# EAGLE schematic md_ver10.1 (EAGLE 6.2)
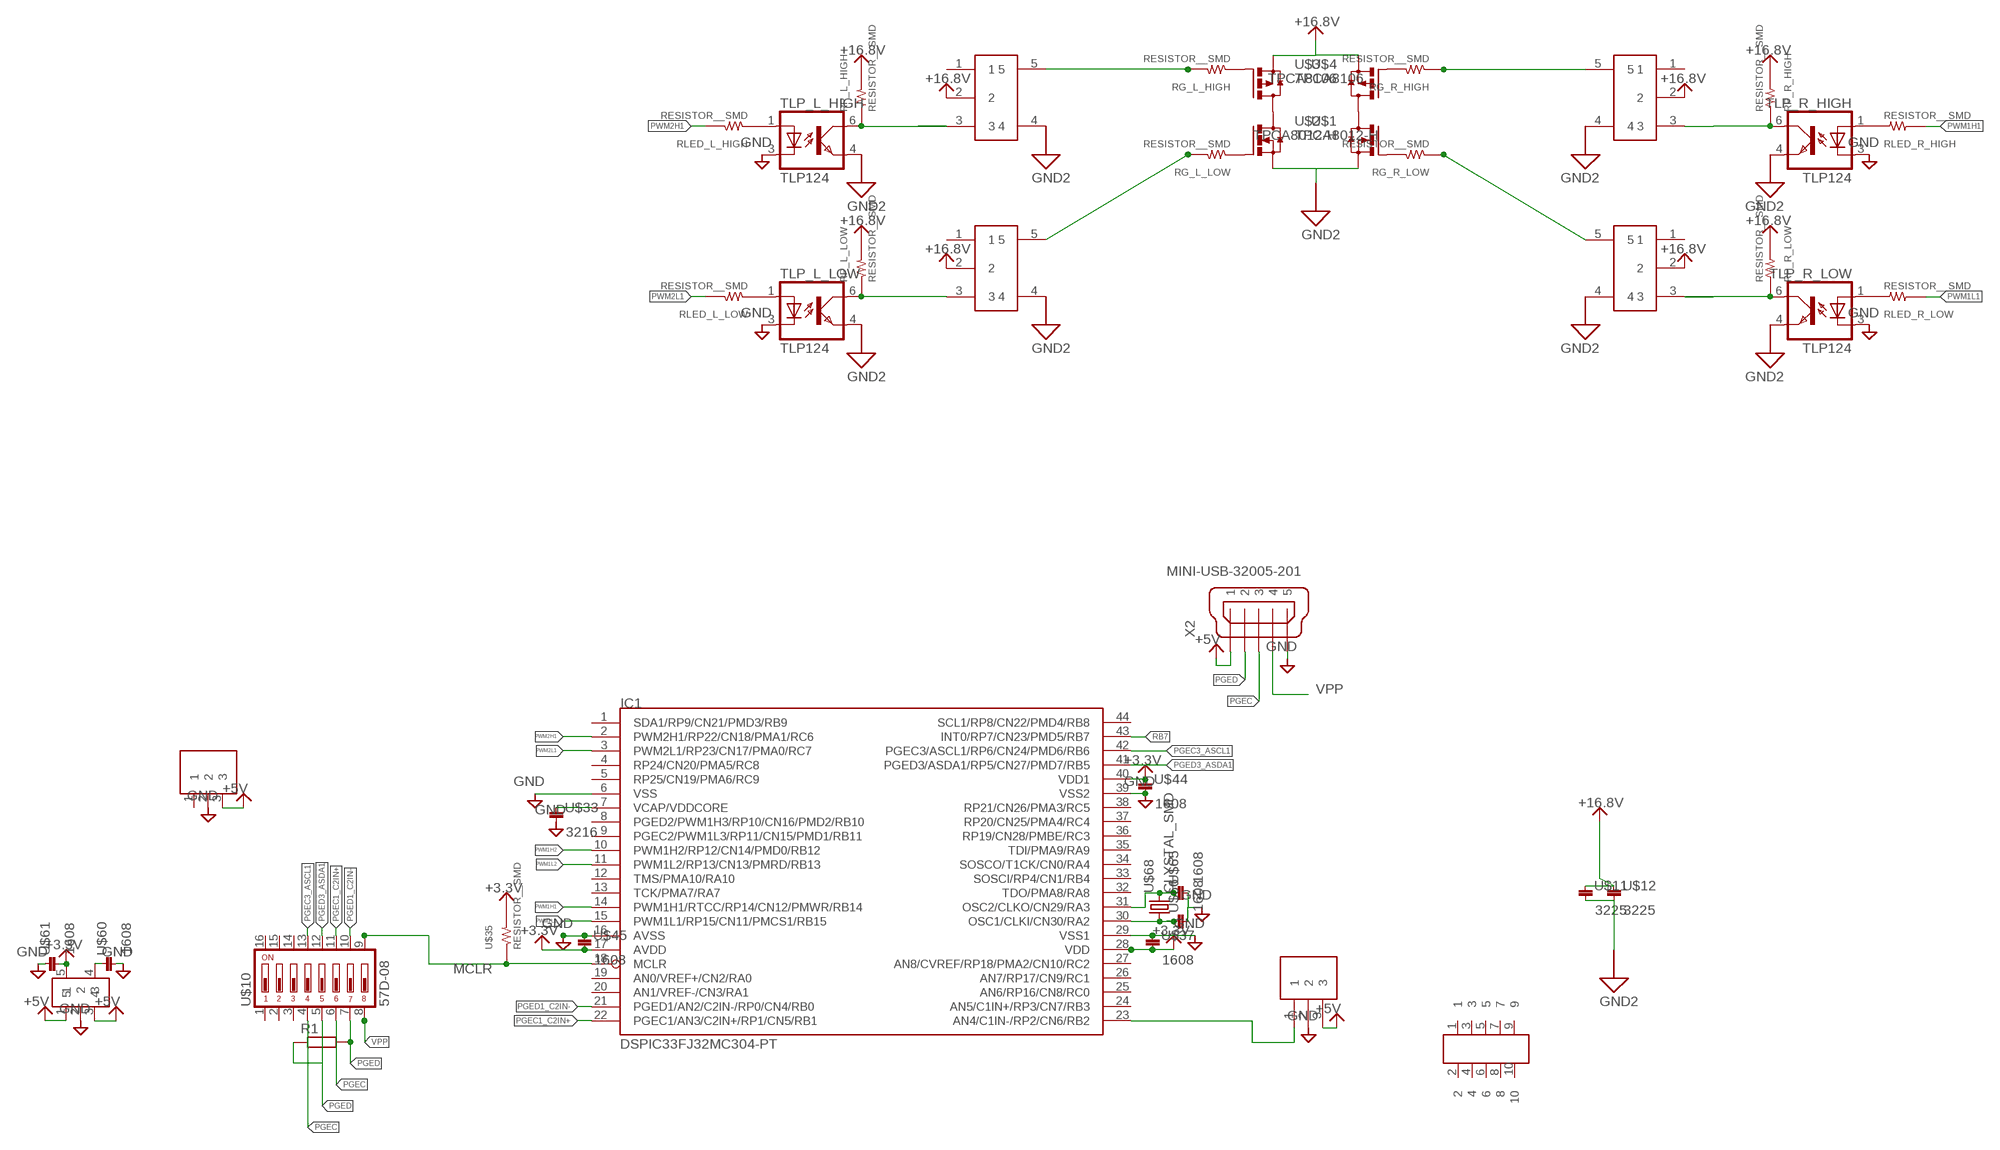
[diagram p0: schematic, sheet 1]

## Parts
IC1  DSPIC33FJ32MC304-PT  [TQFP44]
IC_L_HIGH  MCP1415  [SOT23-5L]
IC_L_LOW  MCP1415  [SOT23-5L]
IC_R_HIGH  MCP1415  [SOT23-5L]
IC_R_LOW  MCP1415  [SOT23-5L]
R1  R-EU_R3216  [R3216]
RG_L_HIGH  RESISTOR__SMD  [1608]
RG_L_LOW  RESISTOR__SMD  [1608]
RG_R_HIGH  RESISTOR__SMD  [1608]
RG_R_LOW  RESISTOR__SMD  [1608]
RLED_L_HIGH  RESISTOR__SMD  [1608]
RLED_L_LOW  RESISTOR__SMD  [1608]
RLED_R_HIGH  RESISTOR__SMD  [1608]
RLED_R_LOW  RESISTOR__SMD  [1608]
RP_L_HIGH  RESISTOR__SMD  [1608]
RP_L_LOW  RESISTOR__SMD  [1608]
RP_R_HIGH  RESISTOR__SMD  [1608]
RP_R_LOW  RESISTOR__SMD  [1608]
TLP_L_HIGH  TLP124  [11−4C1]
TLP_L_LOW  TLP124  [11−4C1]
TLP_R_HIGH  TLP124  [11−4C1]
TLP_R_LOW  TLP124  [11−4C1]
U$1  TPCA8012-H  [2-5Q1A]
U$2  TPCA8012-H  [2-5Q1A]
U$3  TPCA8106  [2-5Q1A]
U$4  TPCA8106  [2-5Q1A]
U$7  ＰＬ－ＩＲＭ  [ＰＬ－ＩＲＭ]
U$8  Ｒ－７８Ｅ５．０  [Ｒ－７８Ｅ５．０]
U$9  TAR5SB  [SSOP5-P-0.95]
U$10  57D-08  [57D]
U$11  3225  [3225]
U$12  3225  [3225]
U$15  PIN_HEADER_52  [PIN_HEADER_5*2]
U$33  3216  [3216]
U$35  RESISTOR__SMD  [1608]
U$37  1608  [1608]
U$44  1608  [1608]
U$45  1608  [1608]
U$60  1608  [1608]
U$61  1608  [1608]
U$65  1608  [1608]
U$66  1608  [1608]
U$68  CLYSTAL_SMD  [CRYSTAL_SMD]
X2  MINI-USB-32005-201  [32005-201]

## Nets
+3.3V: IC1.17(AVDD) IC1.28(VDD) IC1.40(VDD1) U$9.5 U$35.2 U$37.P$2 U$44.P$1 U$45.P$2 U$61.P$2
+5V: U$7.3 U$8.3 U$9.1 U$9.3 X2.1
+16.8V: IC_L_HIGH.2 IC_L_LOW.2 IC_R_HIGH.2 IC_R_LOW.2 RP_L_HIGH.2 RP_L_LOW.2 RP_R_HIGH.2 RP_R_LOW.2 U$3.1(S) U$3.2(S) U$3.3(S) U$4.1(S) U$4.2(S) U$4.3(S) U$11.P$1 U$12.P$1
GND: IC1.6(VSS) IC1.16(AVSS) IC1.29(VSS1) IC1.39(VSS2) TLP_L_HIGH.3(C) TLP_L_LOW.3(C) TLP_R_HIGH.3(C) TLP_R_LOW.3(C) U$7.2 U$8.2 U$9.2 U$33.P$2 U$37.P$1 U$44.P$2 U$45.P$1 U$60.P$2 U$61.P$1 U$65.P$2 U$66.P$2 X2.5
GND2: IC_L_HIGH.4 IC_L_LOW.4 IC_R_HIGH.4 IC_R_LOW.4 TLP_L_HIGH.4(EMIT) TLP_L_LOW.4(EMIT) TLP_R_HIGH.4(EMIT) TLP_R_LOW.4(EMIT) U$1.1(S) U$1.2(S) U$1.3(S) U$2.1(S) U$2.2(S) U$2.3(S) U$11.P$2 U$12.P$2
M1: U$2.5(D) U$2.6(D) U$2.7(D) U$2.8(D) U$3.5(D) U$3.6(D) U$3.7(D) U$3.8(D)
M2: U$1.5(D) U$1.6(D) U$1.7(D) U$1.8(D) U$4.5(D) U$4.6(D) U$4.7(D) U$4.8(D)
MCLR: IC1.18(MCLR) U$10.9 U$35.1
N$1: RG_L_LOW.1 U$2.4(G)
N$2: U$9.4 U$60.P$1
N$3: RLED_L_LOW.1 TLP_L_LOW.1(A)
N$4: RG_R_LOW.2 U$1.4(G)
N$5: IC_L_LOW.5 RG_L_LOW.2
N$6: IC_L_LOW.3 RP_L_LOW.1 TLP_L_LOW.6(COL)
N$7: IC_R_LOW.5 RG_R_LOW.1
N$9: RLED_R_LOW.1 TLP_R_LOW.1(A)
N$11: IC_L_HIGH.3 RP_L_HIGH.1 TLP_L_HIGH.6(COL)
N$12: RLED_L_HIGH.1 TLP_L_HIGH.1(A)
N$14: IC_L_HIGH.5 RG_L_HIGH.2
N$15: IC_R_HIGH.3 RP_R_HIGH.1 TLP_R_HIGH.6(COL)
N$16: RLED_R_HIGH.1 TLP_R_HIGH.1(A)
N$17: IC1.23(AN4/C1IN-/RP2/CN6/RB2) U$7.1
N$18: IC_R_HIGH.5 RG_R_HIGH.1
N$19: RG_L_HIGH.1 U$3.4(G)
N$20: RG_R_HIGH.2 U$4.4(G)
N$22: IC1.30(OSC1/CLKI/CN30/RA2) U$66.P$1 U$68.1
N$23: IC1.31(OSC2/CLKO/CN29/RA3) U$65.P$1 U$68.2
PGEC: U$10.4 U$10.6 X2.3
PGEC1_C2IN+: IC1.22(PGEC1/AN3/C2IN+/RP1/CN5/RB1) U$10.11
PGEC3_ASCL1: IC1.42(PGEC3/ASCL1/RP6/CN24/PMD6/RB6) U$10.13
PGED: R1.1 R1.2 U$10.5 U$10.7 X2.2
PGED1_C2IN-: IC1.21(PGED1/AN2/C2IN-/RP0/CN4/RB0) U$10.10
PGED3_ASDA1: IC1.41(PGED3/ASDA1/RP5/CN27/PMD7/RB5) U$10.12
PWM1H1: IC1.14(PWM1H1/RTCC/RP14/CN12/PMWR/RB14) RLED_R_HIGH.2
PWM1H2: IC1.10(PWM1H2/RP12/CN14/PMD0/RB12)
PWM1L1: IC1.15(PWM1L1/RP15/CN11/PMCS1/RB15) RLED_R_LOW.2
PWM1L2: IC1.11(PWM1L2/RP13/CN13/PMRD/RB13)
PWM2H1: IC1.2(PWM2H1/RP22/CN18/PMA1/RC6) RLED_L_HIGH.2
PWM2L1: IC1.3(PWM2L1/RP23/CN17/PMA0/RC7) RLED_L_LOW.2
RB7: IC1.43(INT0/RP7/CN23/PMD5/RB7)
TLP_R_LOW: IC_R_LOW.3 RP_R_LOW.1 TLP_R_LOW.6(COL)
VCAP/VDDCORE: IC1.7(VCAP/VDDCORE) U$33.P$1
VPP: U$10.8 X2.4
Unconnected: IC1.1(SDA1/RP9/CN21/PMD3/RB9) IC1.4(RP24/CN20/PMA5/RC8) IC1.5(RP25/CN19/PMA6/RC9) IC1.8(PGED2/PWM1H3/RP10/CN16/PMD2/RB10) IC1.9(PGEC2/PWM1L3/RP11/CN15/PMD1/RB11) IC1.12(TMS/PMA10/RA10) IC1.13(TCK/PMA7/RA7) IC1.19(AN0/VREF+/CN2/RA0) IC1.20(AN1/VREF-/CN3/RA1) IC1.24(AN5/C1IN+/RP3/CN7/RB3) IC1.25(AN6/RP16/CN8/RC0) IC1.26(AN7/RP17/CN9/RC1) IC1.27(AN8/CVREF/RP18/PMA2/CN10/RC2) IC1.32(TDO/PMA8/RA8) IC1.33(SOSCI/RP4/CN1/RB4) IC1.34(SOSCO/T1CK/CN0/RA4) IC1.35(TDI/PMA9/RA9) IC1.36(RP19/CN28/PMBE/RC3) IC1.37(RP20/CN25/PMA4/RC4) IC1.38(RP21/CN26/PMA3/RC5) IC1.44(SCL1/RP8/CN22/PMD4/RB8) IC_L_HIGH.1 IC_L_LOW.1 IC_R_HIGH.1 IC_R_LOW.1 U$8.1 U$10.1 U$10.2 U$10.3 U$10.14 U$10.15 U$10.16 U$15.1 U$15.2 U$15.3 U$15.4 U$15.5 U$15.6 U$15.7 U$15.8 U$15.9 U$15.10

## Library data of the parts
IC1 = microchip-dspic33fjxxmc:DSPIC33FJ32MC304: dsPIC33FJ32MC302/304, dsPIC33FJ64MCX02/X04, AND dsPIC33FJ128MCX02/X04 High-Performance, 16-bit Digital Signal Controllers Operating Range: * Up to 40 MIPS operation (at 3.0V -3.6V): - Industrial temperature range (-40°C to +85°C) - Extended temperature range (-40°C to +125°C) High-Performance DSC CPU: * Modified Harvard architecture * C compiler optimized instruction set * 16-bit wide data path * 24-bit wide instructions * Linear program memory addressing up to 4M instruction words * Linear data memory addressing up to 64 Kbytes * 83 base instructions: mostly 1 word/1 cycle * Two 40-bit accumulators with rounding and saturation options * Flexible and powerful addressing modes: - Indirect - Modulo - Bit-Reversed * Software stack * 16 x 16 fractional/integer multiply operations * 32/16 and 16/16 divide operations * Single-cycle multiply and accumulate: - Accumulator write back for DSP operations - Dual data fetch * Up to ±16-bit shifts for up to 40-bit data Direct Memory Access (DMA): * 8-channel hardware DMA * Up to 2 Kbytes dual ported DMA buffer area (DMA RAM) to store data transferred via DMA: - Allows data transfer between RAM and a peripheral while CPU is executing code (no cycle stealing) * Most peripherals support DMA Timers/Capture/Compare/PWM: * Timer/Counters, up to five 16-bit timers: - Can pair up to make two 32-bit timers - One timer runs as a Real-Time Clock with an external 32.768 kHz oscillator - Programmable prescaler * Input Capture (up to four channels): - Capture on up, down or both edges - 16-bit capture input functions - 4-deep FIFO on each capture * Output Compare (up to four channels): - Single or Dual 16-bit Compare mode - 16-bit Glitchless PWM mode * Hardware Real-Time Clock/Calendar (RTCC): - Provides clock, calendar, and alarm functions Interrupt Controller: * 5-cycle latency * Up to 53 available interrupt sources * Up to three external interrupts * Seven programmable priority levels * Five processor exceptions Digital I/O: * Peripheral pin Select functionality * Up to 35 programmable digital I/O pins * Wake-up/Interrupt-on-Change for up to 31 pins * Output pins can drive from 3.0V to 3.6V * Up to 5V output with open drain configuration * All digital input pins are 5V tolerant * 4 mA sink on all I/O pins On-Chip Flash and SRAM: * Flash program memory (up to 128 Kbytes) * Data SRAM (up to 16 Kbytes) * Boot, Secure, and General Security for program Flash System Management: * Flexible clock options: - External, crystal, resonator, internal RC - Fully integrated Phase-Locked Loop (PLL) - Extremely low jitter PLL * Power-up Timer * Oscillator Start-up Timer/Stabilizer * Watchdog Timer with its own RC oscillator * Fail-Safe Clock Monitor * Reset by multiple sources Power Management: * On-chip 2.5V voltage regulator * Switch between clock sources in real time * Idle, Sleep, and Doze modes with fast wake-up Analog-to-Digital Converters (ADCs): * 10-bit, 1.1 Msps or 12-bit, 500 Ksps conversion: - Two and four simultaneous samples (10-bit ADC) - Up to nine input channels with auto-scanning - Conversion start can be manual or synchronized with one of four trigger sources - Conversion possible in Sleep mode - ±2 LSb max integral nonlinearity - ±1 LSb max differential nonlinearity Audio Digital-to-Analog Converter (DAC): - 16-bit Dual Channel DAC module - 100 Ksps maximum sampling rate - Second-Order Digital Delta-Sigma Modulator Comparator Module: * Two analog comparators with programmable input/output configuration CMOS Flash Technology: * Low-power, high-speed Flash technology * Fully static design * 3.3V (±10%) operating voltage * Industrial and Extended temperature * Low power consumption Motor Control Peripherals: * 6-channel 16-bit Motor Control PWM: - Three duty cycle generators - Independent or Complementary mode - Programmable dead-time and output polarity - Edge-aligned or center-aligned - Manual output override control - One Fault input - Trigger for ADC conversions - PWM frequency for 16-bit resolution (@ 40 MIPS) = 1220 Hz for Edge-Aligned mode, 610 Hz for Center-Aligned mode - PWM frequency for 11-bit resolution (@ 40 MIPS) = 39.1 kHz for Edge-Aligned mode, 19.55 kHz for Center-Aligned mode * 2-channel 16-bit Motor Control PWM: - One duty cycle generator - Independent or Complementary mode - Programmable dead time and output polarity - Edge-aligned or center-aligned - Manual output override control - One Fault input - Trigger for ADC conversions - PWM frequency for 16-bit resolution (@ 40 MIPS) = 1220 Hz for Edge-Aligned mode, 610 Hz for Center-Aligned mode - PWM frequency for 11-bit resolution (@ 40 MIPS) = 39.1 kHz for Edge-Aligned mode, 19.55 kHz for Center-Aligned mode * 2-Quadrature Encoder Interface module: - Phase A, Phase B, and index pulse input - 16-bit up/down position counter - Count direction status - Position Measurement (x2 and x4) mode - Programmable digital noise filters on inputs - Alternate 16-bit Timer/Counter mode - Interrupt on position counter rollover/underflow
IC_L_HIGH IC_L_LOW IC_R_HIGH IC_R_LOW = 04_IC:MCP1415
R1 = resistor:R-EU_: RESISTOR, European symbol
RG_L_HIGH RG_L_LOW RG_R_HIGH RG_R_LOW RLED_L_HIGH RLED_L_LOW RLED_R_HIGH RLED_R_LOW RP_L_HIGH RP_L_LOW RP_R_HIGH RP_R_LOW U$35 = 01_R:RESISTOR__SMD
TLP_L_HIGH TLP_L_LOW TLP_R_HIGH TLP_R_LOW = 04_IC:TLP124
U$1 U$2 = 06_FET:TPCA8012-H
U$3 U$4 = 06_FET:TPCA8106
U$7 = 04_IC:ＰＬ－ＩＲＭ
U$8 = 04_IC:Ｒ－７８Ｅ５．０
U$9 = 04_IC:TAR5SB
U$10 = switch:57D-08
U$11 U$12 = 02_C:3225
U$15 = 08_CONECTOR:PIN_HEADER_5*2
U$33 = 02_C:3216
U$37 U$44 U$45 U$60 U$61 U$65 U$66 = 02_C:1608
U$68 = CRYSTAL:CLYSTAL_SMD
X2 = con-cypressindustries:MINI-USB-: MINI USB-B Conector Source: www.cypressindustries.com; OC_FARNELL: unknown; OC_NEWARK: unknown